# EasyEDA schematic SCH_Esquematico_pastillero.json
TITLE: Dosificador de pastillas; REV: 1.0; Date: 2025-05-20; Sheet: 1/1; Drawn By: Olaya; Company: Your Company
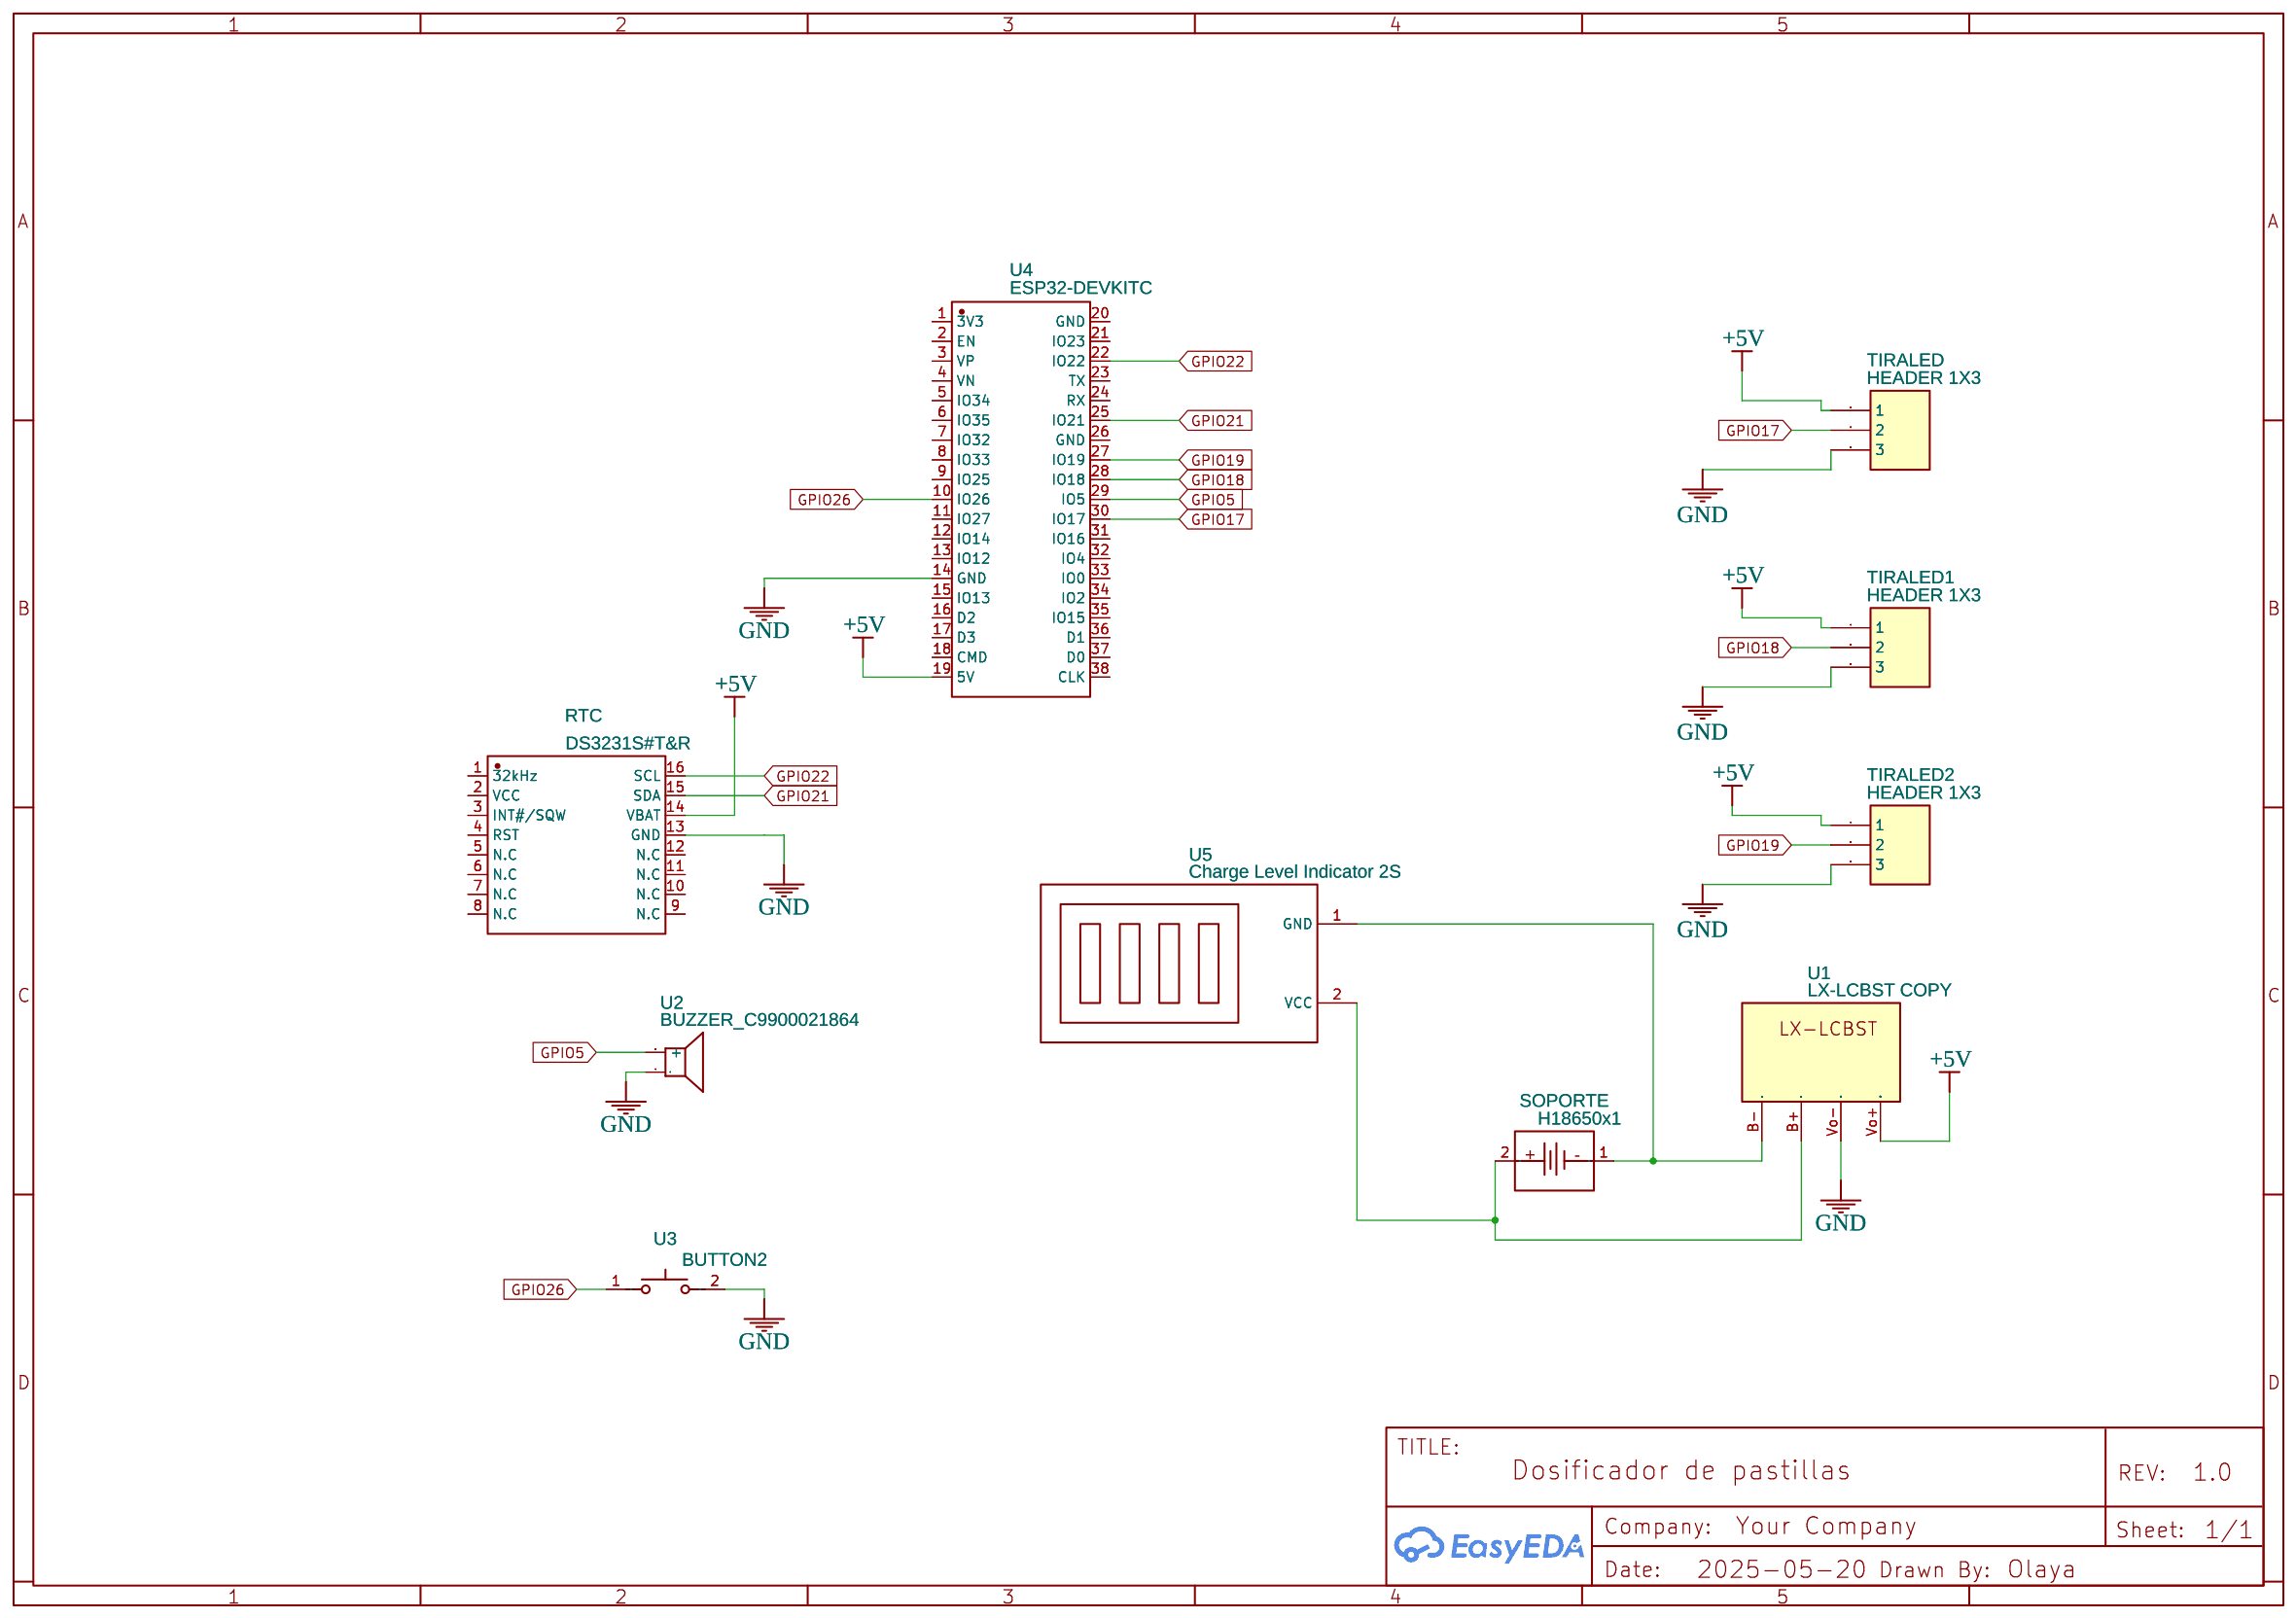
[diagram p0: schematic sheet]

## Parts
RTC  DS3231S#T&R  [SOIC-16_L10.3-W7.5-P1.27-LS10.3-BL]
SOPORTE  H18650x1  [18650X1]
TIRALED  HEADER 1X3  [HDR-TH_12P-P2.54_FE-HDR1X3-2.54-S]
TIRALED1  HEADER 1X3  [HDR-TH_12P-P2.54_FE-HDR1X3-2.54-S]
TIRALED2  HEADER 1X3  [HDR-TH_12P-P2.54_FE-HDR1X3-2.54-S]
U1  LX-LCBST COPY  [LX-LCBST]
U2  BUZZER_C9900021864  [BUZ-SMD_BUZZER]
U3  BUTTON2  [SW-SMD_L6.0-W3.5-LS8.0-1]
U4  ESP32-DEVKITC  [BULETM-SMD_ESP32-DEVKITC]
U5  Charge Level Indicator 2S  [CHARGE LEVEL INDICATOR 2S]

## Library data of the parts
RTC = DS3231S#T&amp;R: Contributor: LCSC; Supplier: LCSC; Supplier Part: C2651514; Manufacturer: ADI(亚德诺)/MAXIM(美信); JLCPCB Part Class: Extended Part
SOPORTE = H18650x1: Contributor: bkelec; JLCPCB Part Class: Extended Part
TIRALED TIRALED1 TIRALED2 = HEADER 1X3: Contributor: Ashraf7794
U1 = LX-LCBST COPY: Contributor: adrirobot
U2 = BUZZER_C9900021864: Contributor: lcsc; Supplier: LCSC; Supplier Part: C9900021864; Manufacturer: null; Manufacturer Part: BUZZER; JLCPCB Part Class: Extended Part
U3 = BUTTON2: Contributor: LCSC; Supplier: LCSC; Supplier Part: C9900005988; Manufacturer: null; JLCPCB Part Class: Extended Part
U4 = ESP32-DEVKITC: Supplier: LCSC; Supplier Part: C571180; Manufacturer: ESPRESSIF(乐鑫); Manufacturer Part: ESP32-DevKitC; Contributor: lcsc; JLCPCB Part Class: Extended Part
U5 = Charge Level Indicator 2S: Contributor: Leonardo Oliveira

## Nets
+5V: RTC.14(VBAT) TIRALED.1 TIRALED1.1 TIRALED2.1 U1.Vo+(Vout+) U4.19(5V)
GND: RTC.13(GND) TIRALED.3 TIRALED1.3 TIRALED2.3 U1.Vo-(Vout-) U2.1 U3.2 U4.14(GND)
GPIO5: U2.2(+) U4.29(IO5)
GPIO17: TIRALED.2 U4.30(IO17)
GPIO18: TIRALED1.2 U4.28(IO18)
GPIO19: TIRALED2.2 U4.27(IO19)
GPIO21: RTC.15(SDA) U4.25(IO21)
GPIO22: RTC.16(SCL) U4.22(IO22)
GPIO26: U3.1 U4.10(IO26)
Net-(SOPORTE-1): SOPORTE.1 U1.B- U5.1(GND)
Net-(SOPORTE-2): SOPORTE.2 U1.B+ U5.2(VCC)

Not connected (* = marked no-connect by the designer): RTC 1(32kHz) 2(VCC) 3(INT#/SQW) 4(RST) 5(N.C) 6(N.C) 7(N.C) 8(N.C) 9(N.C) 10(N.C) 11(N.C) 12(N.C); U4 1(3V3) 2(EN) 3(VP) 4(VN) 5(IO34) 6(IO35) 7(IO32) 8(IO33) 9(IO25) 11(IO27) 12(IO14) 13(IO12) 15(IO13) 16(D2) 17(D3) 18(CMD) 20(GND) 21(IO23) 23(TX) 24(RX) 26(GND) 31(IO16) 32(IO4) 33(IO0) 34(IO2) 35(IO15) 36(D1) 37(D0) 38(CLK)
